# Altium schematic sheet main.SchDoc: Main schematic
size A4; Author: HappyDonuts; Revision: 1.0; SheetNumber: 1; SheetTotal: 1; SPICEModelCacheYSUBEUBN: <root> / <DocumentId>YSUBEUBN</DocumentId> / <CacheFrame Number="0"> / <Model Name="skydiode" Kind="MDL"> / <Text>*Default Schottky Diode / *Schottky Diode Pinout: A,K / .MODEL SKYDIODE D(EG=0.69 XTI=2)</Text> / </Model> / </CacheFrame> / </root>
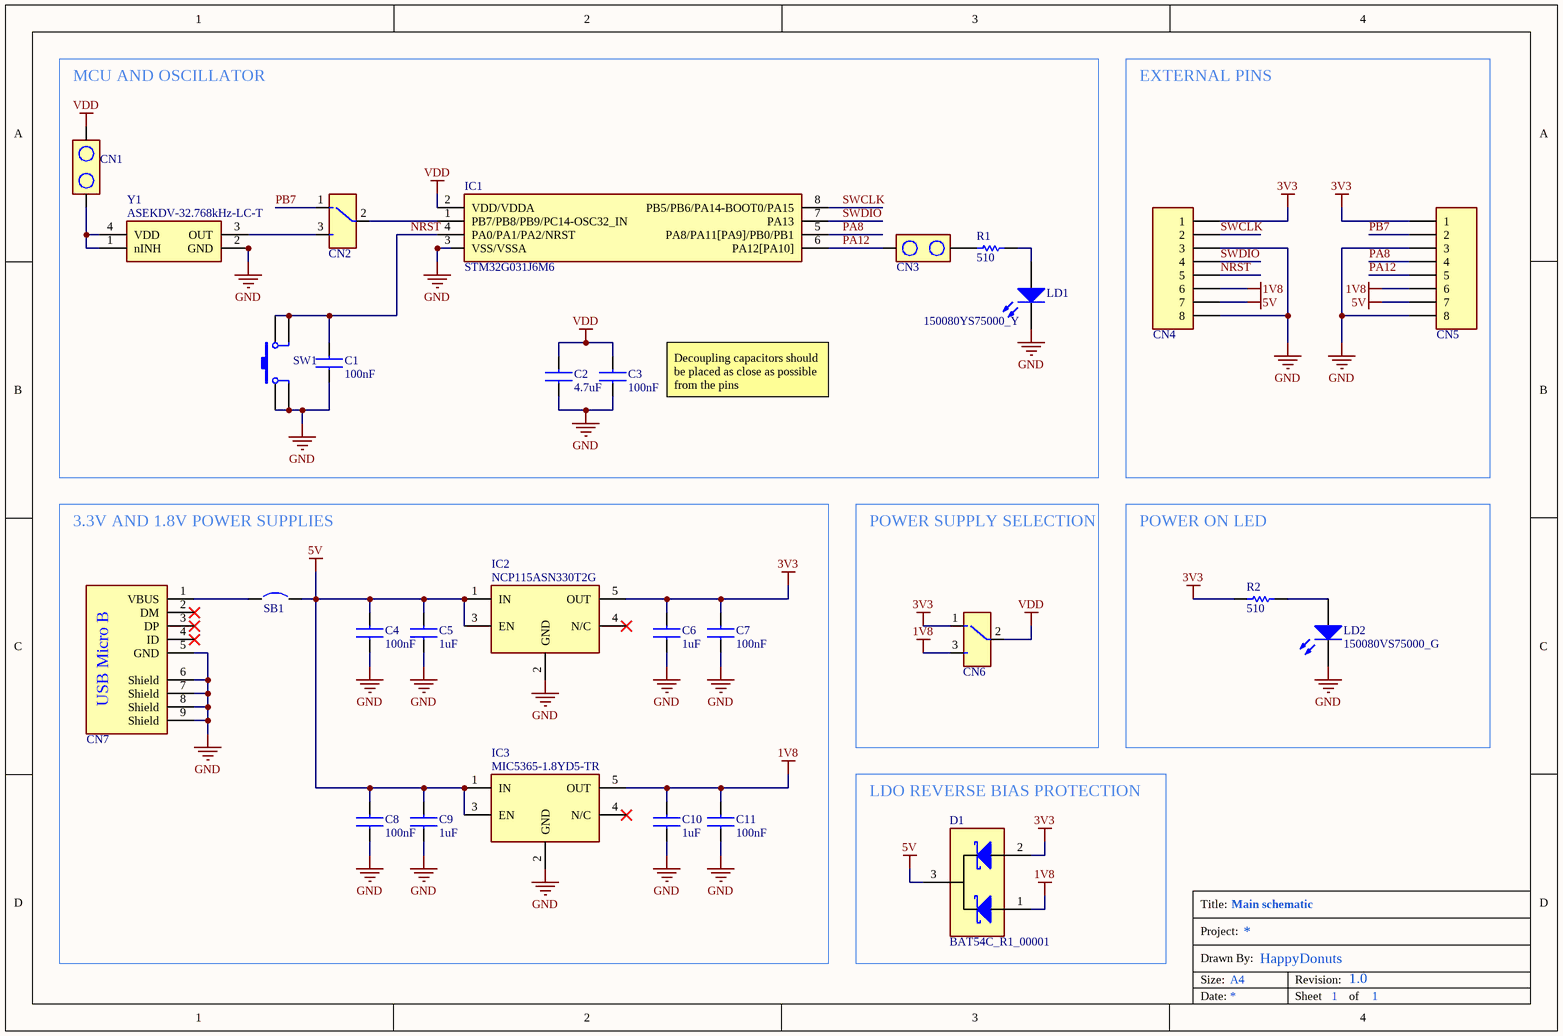
[diagram p0: main.SchDoc]

## Parts
C1  value 100nF  [CAPC2012X94N]  (hidden comment: C0805C104K5RAC7411)
C2  value 4.7uF  [CAPC2012X135N]  (hidden comment: CL21A475KPFNNNE)
C3  value 100nF  [CAPC2012X94N]  (hidden comment: C0805C104K5RAC7411)
C4  value 100nF  [CAPC2012X94N]  (hidden comment: C0805C104K5RAC7411)
C5  value 1uF  [CAPC2012X135N]  (hidden comment: 885012107015)
C6  value 1uF  [CAPC2012X135N]  (hidden comment: 885012107015)
C7  value 100nF  [CAPC2012X94N]  (hidden comment: C0805C104K5RAC7411)
C8  value 100nF  [CAPC2012X94N]  (hidden comment: C0805C104K5RAC7411)
C9  value 1uF  [CAPC2012X135N]  (hidden comment: 885012107015)
C10  value 1uF  [CAPC2012X135N]  (hidden comment: 885012107015)
C11  value 100nF  [CAPC2012X94N]  (hidden comment: C0805C104K5RAC7411)
CN1  CN_2PIN  [CN_2PIN]  (value not drawn)
CN2  CN_3PIN  [CN_3PIN]  (value not drawn)
CN3  CN_2PIN  [CN_2PIN]  (value not drawn)
CN4  CN_8PIN  [CN_8PIN]  (value not drawn)
CN5  CN_8PIN  [CN_8PIN]  (value not drawn)
CN6  CN_3PIN  [CN_3PIN]  (value not drawn)
CN7  920-E52A2021S10100  [USB307530A]  (value not drawn)
D1  BAT54C_R1_00001  [SOT95P240X110-3N]
IC1  STM32G031J6M6  [SOIC127P600X175-8N]
IC2  NCP115ASN330T2G  [SOT95P275X110-5N]
IC3  MIC5365-1.8YD5-TR  [SOT95P275X110-5N]
LD1  150080YS75000_Y  [LEDC2012X85N_Y]
LD2  150080VS75000_G  [LEDC2012X85N_G]
R1  value 510  [RESC2012X60N]  (hidden comment: RC0805FR-07510RL)
R2  value 510  [RESC2012X60N]  (hidden comment: RC0805FR-07510RL)
SB1  RC0805FR-070RL  [RESC2012X60N]  (value not drawn)
SW1  EVP-BT3G4A000  [EVP-BT3G4A000]  (value not drawn)
Y1  ASEKDV-32.768kHz-LC-T  [ASEKDV-32.768kHz-LC-T]

## Blocks framed on the sheet
MCU AND OSCILLATOR: C1-C3 CN1-CN3 IC1 LD1 R1 SW1 Y1
EXTERNAL PINS: CN4 CN5
POWER SUPPLY SELECTION: CN6
POWER ON LED: LD2 R2
LDO REVERSE BIAS PROTECTION: D1

## Nets
1V8: C10.2 C11.2 CN4.6 CN5.6 CN6.3 D1.1(K_1) IC3.5(OUT)
3V3: C6.2 C7.2 CN4.1 CN5.1 CN6.1 D1.2(K_2) IC2.5(OUT) R2.1
5V: C4.2 C5.2 C8.2 C9.2 CN4.7 CN5.7 D1.3(COM_A) IC2.1(IN) IC2.3(EN) IC3.1(IN) IC3.3(EN) SB1.2
GND: C1.1 C2.1 C3.1 C4.1 C5.1 C6.1 C7.1 C8.1 C9.1 C10.1 C11.1 CN4.3 CN4.8 CN5.3 CN5.8 CN7.5(GND) CN7.6(Shield) CN7.7(Shield) CN7.8(Shield) CN7.9(Shield) IC1.3(VSS/VSSA) IC2.2(GND) IC3.2(GND) LD1.1(K) LD2.1(K) SW1.1 SW1.2 Y1.2(GND)
VDD: C2.2 C3.2 CN1.2 CN6.2 IC1.2(VDD/VDDA)
NRST: C1.2 CN4.5 IC1.4(PA0/PA1/PA2/NRST) SW1.3 SW1.4
PA8: CN5.4 IC1.5(PA8/PA11[PA9]/PB0/PB1)
PA12: CN3.1 CN5.5 IC1.6(PA12[PA10])
PB7: CN2.1 CN5.2
SWCLK: CN4.2 IC1.8(PB5/PB6/PA14-BOOT0/PA15)
SWDIO: CN4.4 IC1.7(PA13)
NetCN1_1: CN1.1 Y1.1(nINH) Y1.4(VDD)
NetCN2_2: CN2.2 IC1.1(PB7/PB8/PB9/PC14-OSC32_IN)
NetCN2_3: CN2.3 Y1.3(OUT)
NetCN3_2: CN3.2 R1.1
NetCN7_1: CN7.1(VBUS) SB1.1
NetLD1_2: LD1.2(A) R1.2
NetLD2_2: LD2.2(A) R2.2

Not connected (* = marked no-connect by the designer): CN7 2(DM)* 3(DP)* 4(ID)*; IC2 4(N/C)*; IC3 4(N/C)*

## Notes on the sheet
- Decoupling capacitors should be placed as close as possible from the pins
- 3.3V AND 1.8V POWER SUPPLIES
- USB Micro B
- Title:
- Size:
- Date:
- Drawn By:
- Project:
- A4
- Revision:
- Sheet
- of

## Library data of the parts
C1 C3 C4 C7 C8 C11 = C0805C104K5RAC7411: Capacitor; Manufacturer_Name: Kemet; Datasheet Link: https://www.mouser.com/datasheet/2/212/KEM_C1002_X7R_SMD-1102033.pdf; Height: 0.88mm; Manufacturer_Part_Number: C0805C104K5RAC7411; Mouser Part Number: 80-C0805C104K5RACLR; Mouser Price/Stock: https://www.mouser.co.uk/ProductDetail/KEMET/C0805C104K5RAC7411?qs=jbRM9o5BbzPcVXF0wW9AYg%3D%3D; Arrow Part Number: C0805C104K5RAC7411; Arrow Price/Stock: https://www.arrow.com/en/products/c0805c104k5rac7411/kemet-corporation
C2 = CL21A475KPFNNNE: Capacitor; Manufacturer_Name: Wurth Elektronik; Datasheet Link: https://www.mouser.fr/datasheet/2/585/MLCC-1837944.pdf; Height: 1.35mm; Manufacturer_Part_Number: CL21A475KPFNNNE; Mouser Part Number: 187-CL21A475KPFNNNE; Mouser Price/Stock: https://www.mouser.co.uk/ProductDetail/Wurth-Elektronik/885012107015?qs=0KOYDY2FL2%252BNQREZP%252BtVoQ%3D%3D
C5 C6 C9 C10 = 885012107015: Capacitor; Manufacturer_Name: Wurth Elektronik; Datasheet Link: https://katalog.we-online.com/pbs/datasheet/885012107015.pdf; Height: 1.35mm; Manufacturer_Part_Number: 885012107015; Mouser Part Number: 710-885012107015; Mouser Price/Stock: https://www.mouser.co.uk/ProductDetail/Wurth-Elektronik/885012107015?qs=0KOYDY2FL2%252BNQREZP%252BtVoQ%3D%3D
CN1 CN3 = CN_2PIN: Connector
CN2 CN6 = CN_3PIN: Connector
CN4 CN5 = CN_8PIN: Connector
CN7 = 920-E52A2021S10100: USB connector; Manufacturer_Name: Jing Extension of the Electronic Co.; Datasheet Link: http://toshiba.semicon-storage.com/info/docget.jsp?did=65346&prodName=TB67H450FNG; Height: 1.9mm; Manufacturer_Part_Number: https://datasheet.lcsc.com/lcsc/2103051832_Jing-Extension-of-the-Electronic-Co--920-E52A2021S10100_C10418.pdf; Mouser Part Number: 920-E52A2021S10100; Mouser Price/Stock: https://www.mouser.co.uk/ProductDetail/Toshiba/TB67H450FNGEL?qs=h6V4JsTaLXeReNg2bp0jug%3D%3D; Arrow Part Number: TB67H450FNG,EL; Arrow Price/Stock: https://www.arrow.com/en/products/tb67h450fngel/toshiba?region=nac
D1 = BAT54C_R1_00001: Schottky Diode; Manufacturer_Name: PANJIT; Datasheet Link: https://www.mouser.com/datasheet/2/1057/BAT54_SERIES-1868988.pdf; Height: 1.1mm; Manufacturer_Part_Number: BAT54C_R1_00001; Mouser Part Number: 241-BAT54C_R1_00001; Mouser Price/Stock: https://www.mouser.co.uk/ProductDetail/Panjit/BAT54C_R1_00001?qs=sPbYRqrBIVlWgFH05T87cA%3D%3D
IC1 = STM32G031J6M6: Integrated Circuit; Manufacturer_Name: STMicroelectronics; Datasheet Link: https://www.mouser.fr/datasheet/2/389/dm00613879-1799607.pdf; Height: 1.75mm; Manufacturer_Part_Number: STM32G031J6M6; Mouser Part Number: 511-STM32G031J6M6
IC2 = NCP115ASN330T2G: Integrated Circuit; Manufacturer_Name: ON Semiconductor; Value: 3.3V/300mA; Datasheet Link: http://www.onsemi.com/pub/Collateral/NCP115-D.PDF; Height: 1.1mm; Manufacturer_Part_Number: NCP115ASN330T2G; Mouser Part Number: 863-NCP115ASN330T2G; Mouser Price/Stock: https://www.mouser.co.uk/ProductDetail/onsemi/NCP115ASN330T2G?qs=byeeYqUIh0PuUump9WHLUw%3D%3D; Arrow Part Number: NCP115ASN330T2G; Arrow Price/Stock: https://www.arrow.com/en/products/ncp115asn330t2g/on-semiconductor?region=europe
IC3 = MIC5365-1.8YD5-TR: Integrated Circuit; Manufacturer_Name: Microchip; Value: 1.8V/150mA; Datasheet Link: http://ww1.microchip.com/downloads/en/DeviceDoc/mic5365.pdf; Height: 1mm; Manufacturer_Part_Number: MIC5365-1.8YD5-TR; Mouser Part Number: 998-MIC5365-1.8YD5TR; Mouser Price/Stock: https://www.mouser.co.uk/ProductDetail/Microchip-Technology-Micrel/MIC5365-18YD5-TR?qs=U6T8BxXiZAVg0QgzW6KbsQ%3D%3D; Arrow Part Number: MIC5365-1.8YD5-TR; Arrow Price/Stock: https://www.arrow.com/en/products/mic5365-1.8yd5-tr/microchip-technology?region=nac
LD1 = 150080YS75000_Y: LED; Manufacturer_Name: Wurth Elektronik; Value: Yellow; Datasheet Link: https://katalog.we-online.de/led/datasheet/150080YS75000.pdf; Height: 0.8mm; Manufacturer_Part_Number: 150080YS75000; Mouser Part Number: 710-150080YS75000; Mouser Price/Stock: https://www.mouser.co.uk/ProductDetail/Wurth-Elektronik/150080YS75000?qs=LlUlMxKIyB3k0fZGrDMI2w%3D%3D
LD2 = 150080VS75000_G: LED; Manufacturer_Name: Wurth Elektronik; Value: Green; Datasheet Link: https://www.mouser.fr/datasheet/2/445/150080VS75000-1714385.pdf; Height: 0.8mm; Manufacturer_Part_Number: 150080VS75000; Mouser Part Number: 710-150080VS75000
R1 R2 = RC0805FR-07510RL: Resistor; Manufacturer_Name: YAGEO (PHYCOMP); Datasheet Link: https://datasheet.datasheetarchive.com/originals/distributors/Datasheets_SAMA/902f9e387b938f871d31120f5fc1d65e.pdf; Height: 0.6mm; Manufacturer_Part_Number: RC0805FR-07510RL; Mouser Part Number: 603-RC0805FR-07510RL; Mouser Price/Stock: https://www.mouser.com/Search/Refine.aspx?Keyword=603-RC0805FR-07510RL
SB1 = RC0805FR-070RL: Jumper (0 ohm); Manufacturer_Name: YAGEO (PHYCOMP); Datasheet Link: https://datasheet.datasheetarchive.com/originals/distributors/Datasheets_SAMA/902f9e387b938f871d31120f5fc1d65e.pdf; Height: 0.6mm; Manufacturer_Part_Number: RC0805FR-070RL; Mouser Part Number: 603-RC0805FR-070RL; Mouser Price/Stock: https://www.mouser.co.uk/ProductDetail/YAGEO/RC0805FR-070RL?qs=fRxXYNj8ftF6kXqh1XbZJQ%3D%3D
SW1 = EVP-BT3G4A000: Tactile switch; Manufacturer_Name: Panasonic; Datasheet Link: https://www.mouser.fr/datasheet/2/315/sw_lt_eng_6s_th-2889044.pdf; Height: 3.1mm; Manufacturer_Part_Number: EVP-BT3G4A000
Y1 = ASEKDV-32.768kHz-LC-T: Crystal or Oscillator; Manufacturer_Name: ABRACON; Datasheet Link: https://www.mouser.fr/datasheet/2/3/ABRC_S_A0012625913_1-2519507.pdf; Height: 1.2mm; Manufacturer_Part_Number: ASEKDV-32.768kHz-LC-T; Mouser Part Number: 815-ASEKDV32768KHLCT; Value: 32.768kHz